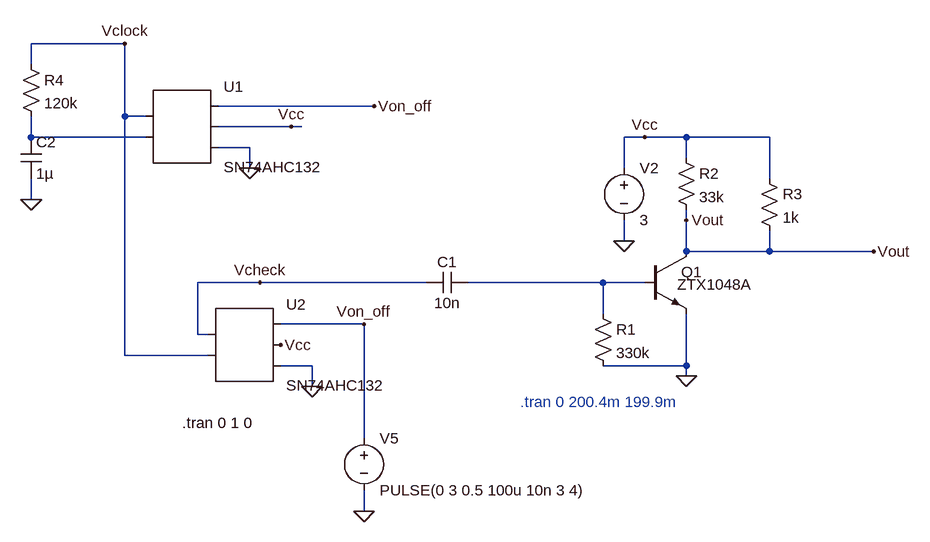
[diagram p0: schematic FES Pulse Train Simulation.asc]
FES Pulse Train Simulation.asc, the LTspice schematic file:
Version 4
SHEET 1 880 680
WIRE -608 -224 -752 -224
WIRE -752 -192 -752 -224
WIRE -224 -128 -464 -128
WIRE -608 -112 -608 -224
WIRE -576 -112 -608 -112
WIRE -352 -96 -464 -96
WIRE -336 -96 -352 -96
WIRE -752 -80 -752 -112
WIRE -576 -80 -752 -80
WIRE 192 -80 160 -80
WIRE 256 -80 192 -80
WIRE 384 -80 256 -80
WIRE -416 -64 -464 -64
WIRE 256 -48 256 -80
WIRE -416 -32 -416 -64
WIRE 160 -32 160 -80
WIRE 384 -16 384 -80
WIRE -752 16 -752 -16
WIRE 256 48 256 32
WIRE 160 80 160 48
WIRE 256 96 256 48
WIRE 384 96 384 64
WIRE 384 96 256 96
WIRE 544 96 384 96
WIRE -400 144 -496 144
WIRE -144 144 -400 144
WIRE 128 144 -80 144
WIRE 192 144 128 144
WIRE 128 192 128 144
WIRE -240 208 -368 208
WIRE -496 224 -496 144
WIRE -480 224 -496 224
WIRE -608 256 -608 -112
WIRE -480 256 -608 256
WIRE -320 272 -368 272
WIRE 256 272 256 192
WIRE 256 272 128 272
WIRE 256 288 256 272
WIRE -320 304 -320 272
WIRE -240 384 -240 208
WIRE -240 496 -240 464
FLAG 256 288 0
FLAG 160 80 0
FLAG 192 -80 Vcc
FLAG 256 48 Vout
FLAG 544 96 Vout
FLAG -416 -32 0
FLAG -752 16 0
FLAG -352 -96 Vcc
FLAG -368 240 Vcc
FLAG -320 304 0
FLAG -240 496 0
FLAG -240 208 Von_off
FLAG -400 144 Vcheck
FLAG -608 -224 Vclock
FLAG -224 -128 Von_off
SYMBOL npn 192 96 R0
WINDOW 3 50 51 Left 2
SYMATTR Value ZTX1048A
SYMATTR InstName Q1
SYMBOL res 112 176 R0
SYMATTR InstName R1
SYMATTR Value 330k
SYMBOL res 240 -64 R0
SYMATTR InstName R2
SYMATTR Value 33k
SYMBOL voltage 160 -48 R0
WINDOW 123 0 0 Left 0
WINDOW 39 0 0 Left 0
SYMATTR InstName V2
SYMATTR Value 3
SYMBOL cap -80 128 R90
WINDOW 0 0 32 VBottom 2
WINDOW 3 32 32 VTop 2
SYMATTR InstName C1
SYMATTR Value 10n
SYMBOL res 368 -32 R0
SYMATTR InstName R3
SYMATTR Value 1k
SYMBOL AutoGenerated\\SN74AHC132 -528 -96 R0
SYMATTR InstName U1
SYMBOL cap -768 -80 R0
SYMATTR InstName C2
SYMATTR Value 1µ
SYMBOL res -768 -208 R0
SYMATTR InstName R4
SYMATTR Value 120k
SYMBOL AutoGenerated\\SN74AHC132 -432 240 R0
SYMATTR InstName U2
SYMBOL voltage -240 368 R0
WINDOW 123 0 0 Left 0
WINDOW 39 0 0 Left 0
SYMATTR InstName V5
SYMATTR Value PULSE(0 3 0.5 100u 10n 3 4)
TEXT 0 328 Left 2 ;.tran 0 200.4m 199.9m
TEXT -520 360 Left 2 !.tran 0 1 0

The netlist it stands for:
* FES Pulse Train Simulation.asc
Q1 Vout N002 0 0 ZTX1048A
R1 N002 0 330k
R2 Vcc Vout 33k
V2 Vcc 0 3
C1 N002 Vcheck 10n
R3 Vcc Vout 1k
* U1: SN74AHC132 (symbol AutoGenerated\SN74AHC132 not available, pins judged from their places): pin1=Vclock pin2=N001 pin3=Von_off pin4=Vcc pin5=0
C2 N001 0 1µ
R4 Vclock N001 120k
* U2: SN74AHC132 (symbol AutoGenerated\SN74AHC132 not available, pins judged from their places): pin1=Vcheck pin2=Vclock pin3=Von_off pin4=Vcc pin5=0
V5 Von_off 0 PULSE(0 3 0.5 100u 10n 3 4)
.model NPN NPN
.model PNP PNP
.lib standard.bjt
* .tran 0 200.4m 199.9m
.tran 0 1 0
.backanno
.end